# EAGLE schematic T-11_Version_1_3 (EAGLE 7.1.0)
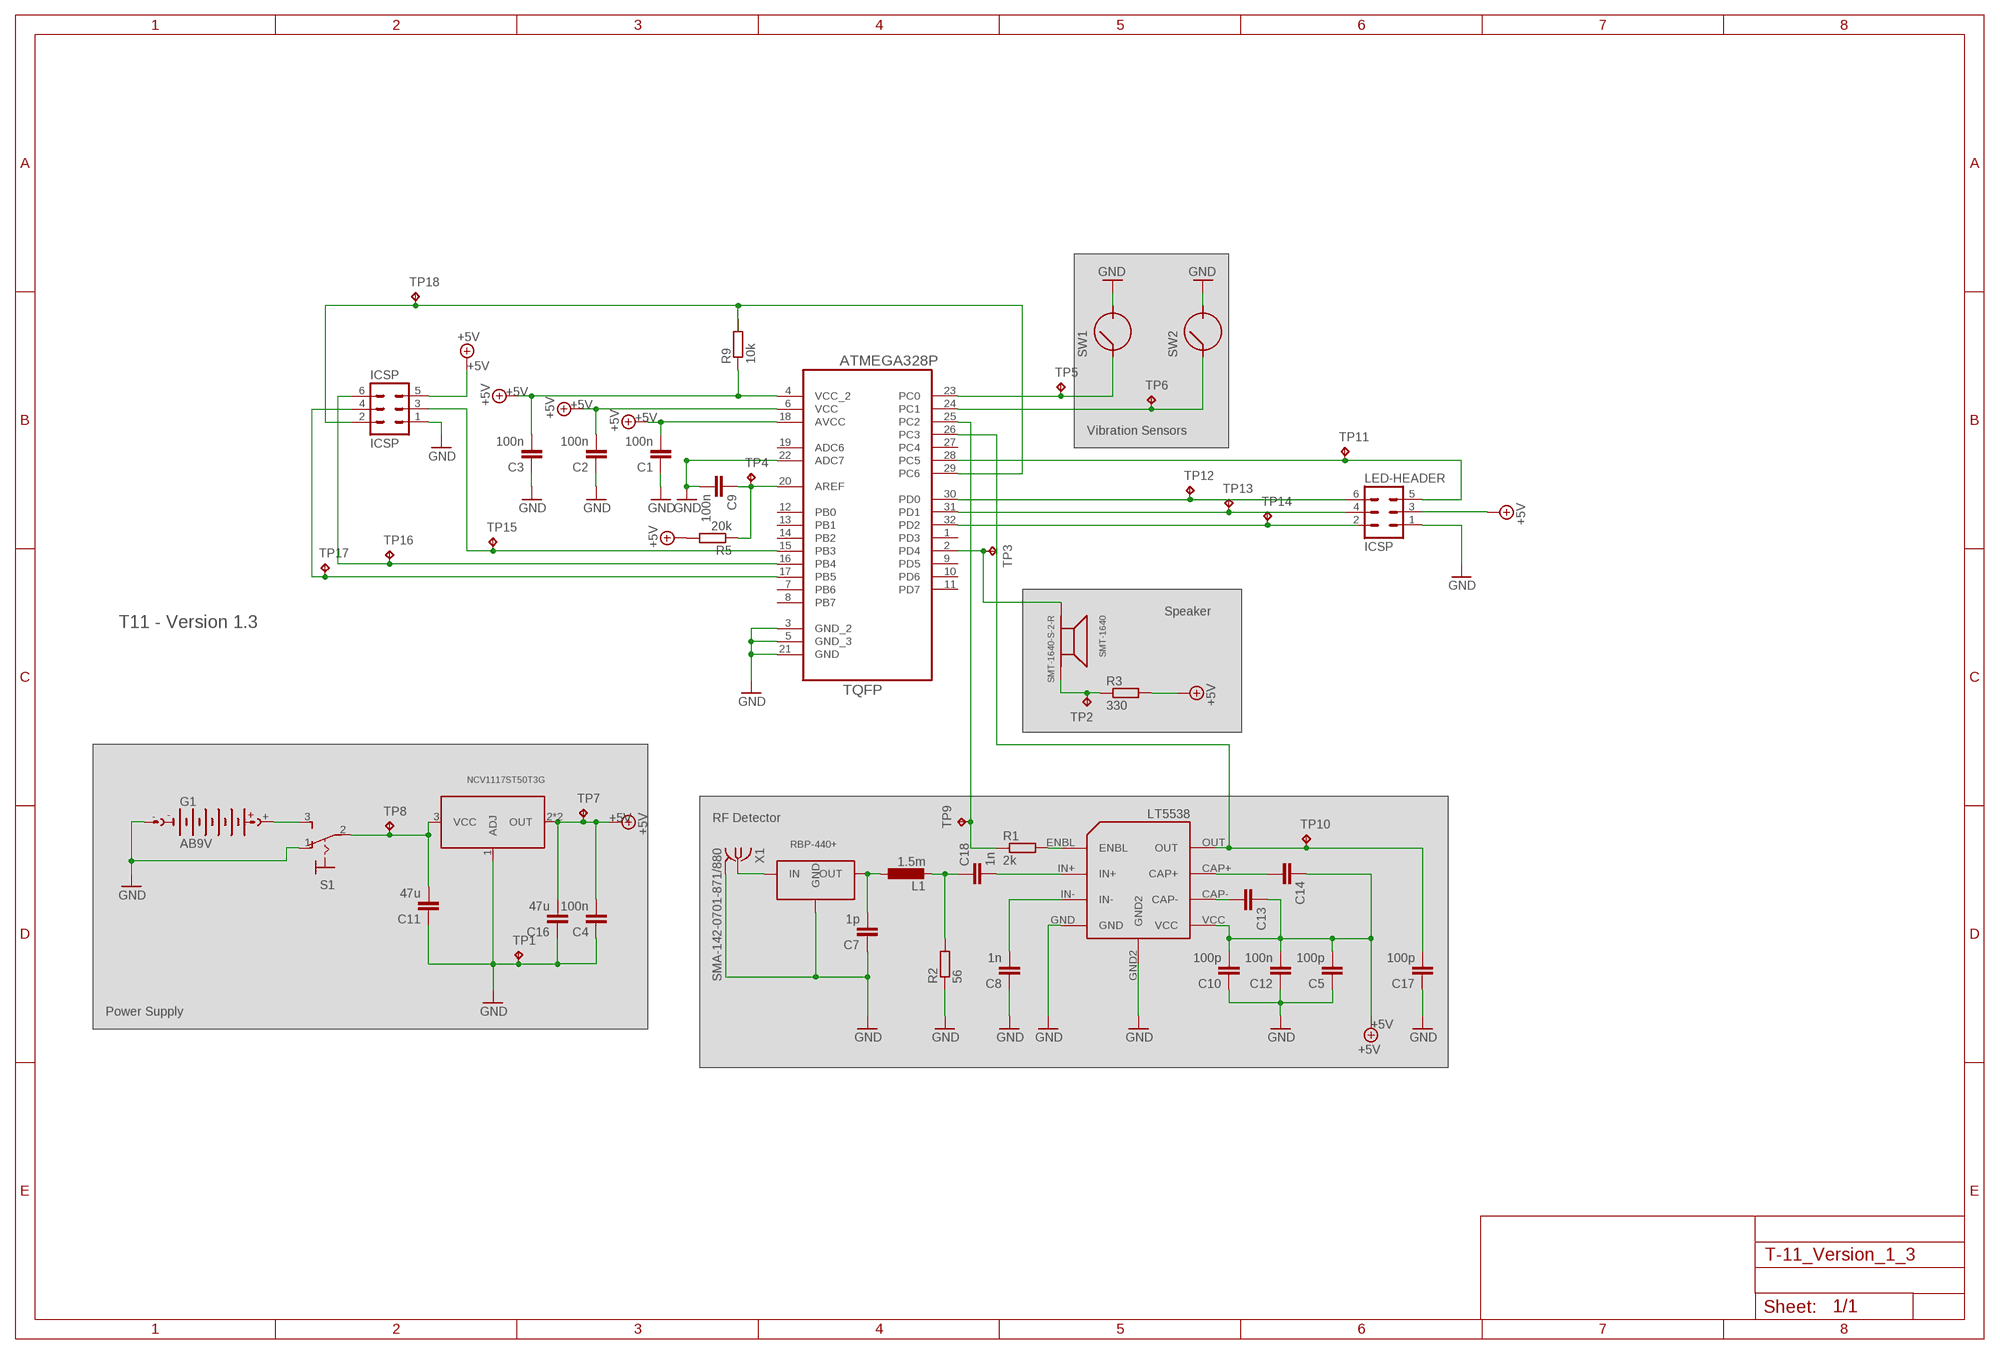
[diagram p0: schematic, sheet 1]

## Parts
C1  100n  C-EUC4532  [C4532]
C2  100n  C-EUC4532  [C4532]
C3  100n  C-EUC4532  [C4532]
C4  100n  C-EUC4532  [C4532]
C5  100p  C-EUC4532  [C4532]
C7  1p  C-EUC4532  [C4532]
C8  1n  C-EUC4532  [C4532]
C9  100n  C-EUC4532  [C4532]
C10  100p  C-EUC4532  [C4532]
C11  47u  C-EUC4532  [C4532]
C12  100n  C-EUC4532  [C4532]
C13  C-EUC4532  [C4532]
C14  C-EUC4532  [C4532]
C16  47u  C-EUC4532  [C4532]
C17  100p  C-EUC4532  [C4532]
C18  1n  C-EUC4532  [C4532]
G1  AB9V  [AB9V]
ICSP  ICSP  MA03-2  [MA03-2]
L1  1.5m  L-EUL4532P  [L4532P]
LED-HEADER  ICSP  MA03-2  [MA03-2]
R1  2k  R-EU_R3225  [R3225]
R2  56  R-EU_R3225  [R3225]
R3  330  R-EU_R3225  [R3225]
R5  20k  R-EU_R3225  [R3225]
R9  10k  R-EU_R3225  [R3225]
RBP-440+  RBP-440+  [GP731]
S1  320-916  [320-916]
SMT-1640  SMT-1640-S-2-R  [SMT-1640]
SW1  SW-1801X  [SW-1801X]
SW2  SW-1801X  [SW-1801X]
TP1  TPTP10R  [TP10R]
TP2  TPTP10R  [TP10R]
TP3  TPTP10R  [TP10R]
TP4  TPTP10R  [TP10R]
TP5  TPTP10R  [TP10R]
TP6  TPTP10R  [TP10R]
TP7  TPTP10R  [TP10R]
TP8  TPTP10R  [TP10R]
TP9  TPTP10R  [TP10R]
TP10  TPTP10R  [TP10R]
TP11  TPTP10R  [TP10R]
TP12  TPTP10R  [TP10R]
TP13  TPTP10R  [TP10R]
TP14  TPTP10R  [TP10R]
TP15  TPTP10R  [TP10R]
TP16  TPTP10R  [TP10R]
TP17  TPTP10R  [TP10R]
TP18  TPTP10R  [TP10R]
U1  ATMEGA328P-AU  [QFP80P900X900X120-32N]
U$1  LT5538  [LT5538]
U$2  NCV1117ST50T3G  [SOT223]
X1  SMA-142-0701-871/880  [SMA-142-0701-871]

## Nets
+5V: C1.2 C2.2 C3.2 C4.2 C5.2 C10.2 C12.2 C13.1 C14.1 C16.2 ICSP.5 LED-HEADER.3 R3.2 R5.2 R9.1 TP7.TP U1.4(VCC_2) U1.6(VCC) U1.18(AVCC) U$1.VCC U$2.2(OUT) U$2.4(OUT)
ANT_IN_1: C7.2 L1.1 RBP-440+.6(OUT)
ANT_IN_2: C18.1 L1.2 R2.2
GND: C1.1 C2.1 C3.1 C4.1 C5.1 C7.1 C8.1 C9.2 C10.1 C11.1 C12.1 C16.1 C17.1 G1.- ICSP.1 LED-HEADER.1 R2.1 RBP-440+.1(GND) RBP-440+.3(GND) RBP-440+.4(GND) RBP-440+.5(GND) RBP-440+.7(GND) RBP-440+.8(GND) S1.1(O) TP1.TP U1.3(GND_2) U1.5(GND_3) U1.21(GND) U1.22(ADC7) U$1.GND U$1.GND2 U$2.1(ADJ) X1.2@1 X1.2@2 X1.2@3 X1.2@4
INDICATOR_1: TP14.TP U1.32(PD2)
INDICATOR_2: LED-HEADER.4 TP13.TP U1.31(PD1)
INDICATOR_3: LED-HEADER.6 TP12.TP U1.30(PD0)
MISO: ICSP.6 TP16.TP U1.16(PB4)
MOSI: ICSP.3 TP15.TP U1.15(PB3)
N$1: LED-HEADER.5 TP11.TP U1.28(PC5)
N$2: RBP-440+.2(IN) X1.1
N$3: R3.1 SMT-1640.P$1(OUT) TP2.TP
N$4: G1.+ S1.3(S)
N$5: C18.2 U$1.IN+
N$6: R1.2 U$1.ENBL
N$8: C14.2 U$1.CAP+
N$9: C13.2 U$1.CAP-
N$10: C9.1 R5.1 TP4.TP U1.20(AREF)
N$12: SMT-1640.P$2(IN) TP3.TP U1.2(PD4)
PS_VIN: C11.2 S1.2(P) TP8.TP U$2.3(VCC)
RESET: ICSP.2 R9.2 TP18.TP U1.29(PC6)
RF_ENABLE: R1.1 TP9.TP U1.25(PC2)
RF_IN-: C8.2 U$1.IN-
RF_OUT: C17.2 TP10.TP U1.26(PC3) U$1.OUT
SCK: ICSP.4 TP17.TP U1.17(PB5)
VIB_1: SW2.P$1 TP6.TP U1.24(PC1)
VIB_2: SW1.P$1 TP5.TP U1.23(PC0)
Unconnected: LED-HEADER.2 SW1.P$2 SW2.P$2 U1.1(PD3) U1.7(PB6) U1.8(PB7) U1.9(PD5) U1.10(PD6) U1.11(PD7) U1.12(PB0) U1.13(PB1) U1.14(PB2) U1.19(ADC6) U1.27(PC4)

## Notes on the sheet
- Vibration Sensors
- Speaker
- T11 - Version 1.3
- RF Detector
- Power Supply

## Library data of the parts
C1-C5 C7-C14 C16-C18 = rcl:C-EU: CAPACITOR, European symbol
G1 = battery:AB9V: 9-V BATTERY CLIP
ICSP LED-HEADER = con-lstb:MA03-2: PIN HEADER; OC_FARNELL: unknown; OC_NEWARK: unknown
L1 = rcl:L-EU: INDUCTOR, European symbol
R1-R3 R5 R9 = rcl:R-EU_: RESISTOR, European symbol
RBP-440+ = RBP:RBP-440+: Band Pass Filter 410 - 470 MHZ
S1 = switch:320-916: TOGGLE SWITCH distributor RS Components
SMT-1640 = SMT:SMT-1640-S-2-R: pizo buzzer
SW1 SW2 = SW18xxx:SW-1801X: Vibration Sensor
TP1-TP18 = testpad:TP: Test pad
U1 = Ava:ATMEGA328P-AU; DESCRIPTION: 8-bit Microcontroller with In-System Programmable Flash; MPN: ATMEGA328P-AU; OC_FARNELL: 1715486; OC_NEWARK: 14R4631; PACKAGE: TQFP-32; SUPPLIER: Atmel
U$1 = LT5538:LT5538
U$2 = sym:NCV1117ST50T3G
X1 = con-coax:SMA-: SMA 50 Ohm End Launch Jack Receptacle - Round Contact Johnson Components Source: www.johnsoncomponents.com .. J502-ND.pdf; MF: JOHNSON COMPONENTS; MPN: 142-0701-871; OC_FARNELL: 1339835; OC_NEWARK: 91B6105